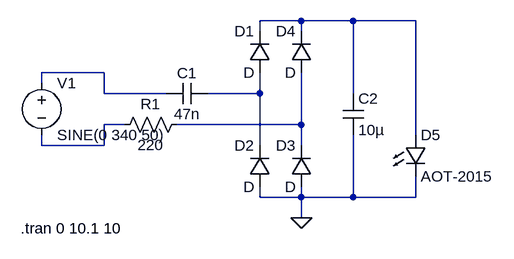
[diagram p0: schematic led_mains.asc]
led_mains.asc, the LTspice schematic file:
Version 4
SHEET 1 880 680
WIRE 448 272 384 272
WIRE 528 272 448 272
WIRE 624 272 528 272
WIRE 384 288 384 272
WIRE 448 288 448 272
WIRE 144 352 48 352
WIRE 48 368 48 352
WIRE 144 384 144 352
WIRE 240 384 144 384
WIRE 384 384 384 352
WIRE 384 384 304 384
WIRE 528 384 528 272
WIRE 176 432 144 432
WIRE 448 432 448 352
WIRE 448 432 256 432
WIRE 624 448 624 272
WIRE 48 464 48 448
WIRE 144 464 144 432
WIRE 144 464 48 464
WIRE 384 464 384 384
WIRE 448 464 448 432
WIRE 384 544 384 528
WIRE 448 544 448 528
WIRE 448 544 384 544
WIRE 528 544 528 448
WIRE 528 544 448 544
WIRE 624 544 624 512
WIRE 624 544 528 544
WIRE 448 576 448 544
FLAG 448 576 0
SYMBOL voltage 48 352 R0
SYMATTR InstName V1
SYMATTR Value SINE(0 340 50)
SYMBOL cap 304 368 R90
WINDOW 0 0 32 VBottom 2
WINDOW 3 32 32 VTop 2
SYMATTR InstName C1
SYMATTR Value 47n
SYMBOL diode 400 352 R180
WINDOW 0 24 64 Left 2
WINDOW 3 24 0 Left 2
SYMATTR InstName D1
SYMBOL diode 400 528 R180
WINDOW 0 24 64 Left 2
WINDOW 3 24 0 Left 2
SYMATTR InstName D2
SYMBOL diode 464 528 R180
WINDOW 0 24 64 Left 2
WINDOW 3 24 0 Left 2
SYMATTR InstName D3
SYMBOL diode 464 352 R180
WINDOW 0 24 64 Left 2
WINDOW 3 24 0 Left 2
SYMATTR InstName D4
SYMBOL res 272 416 R90
WINDOW 0 0 56 VBottom 2
WINDOW 3 32 56 VTop 2
SYMATTR InstName R1
SYMATTR Value 220
SYMBOL LED 608 448 R0
SYMATTR InstName D5
SYMATTR Value AOT-2015
SYMBOL cap 512 384 R0
SYMATTR InstName C2
SYMATTR Value 10µ
TEXT 16 592 Left 2 !.tran 0 10.1 10

The netlist it stands for:
* led_mains.asc
V1 N002 N004 SINE(0 340 50)
C1 N003 N002 47n
D1 N003 N001 D
D2 0 N003 D
D3 0 N005 D
D4 N005 N001 D
R1 N005 N004 220
D5 N001 0 AOT-2015
C2 N001 0 10µ
.model D D
.lib standard.dio
.tran 0 10.1 10
.backanno
.end